# Altium project 烘干机.PrjPcb
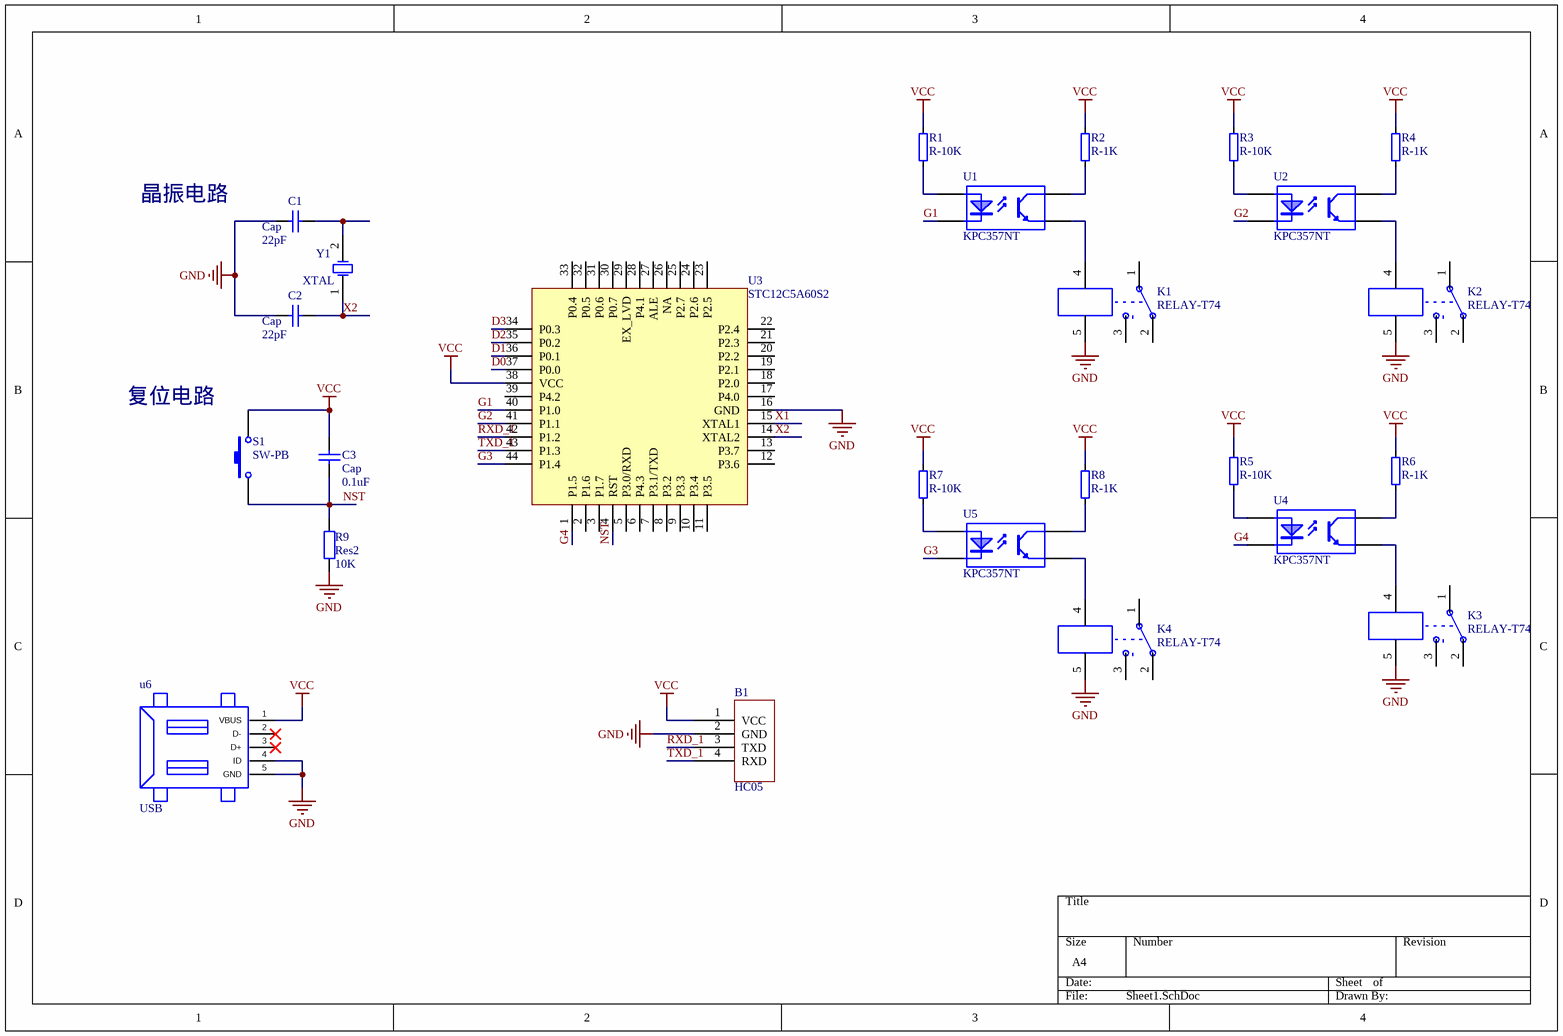
[diagram p0: Sheet1.SchDoc]
1 sheet, 25 parts. Net scope: global (net labels, ports and power ports of the same name join across sheets).

## Sheet Sheet1.SchDoc
size A4

### Parts
B1  HC05
C1  Cap  value 22pF  [RAD-0.3]
C2  Cap  value 22pF  [RAD-0.3]
C3  Cap  value 0.1uF  [RAD-0.3]
K1  RELAY-T74  [RELAY-T74]
K2  RELAY-T74  [RELAY-T74]
K3  RELAY-T74  [RELAY-T74]
K4  RELAY-T74  [RELAY-T74]
R1  R-10K  [0805R]
R2  R-1K  [0805R]
R3  R-10K  [0805R]
R4  R-1K  [0805R]
R5  R-10K  [0805R]
R6  R-1K  [0805R]
R7  R-10K  [0805R]
R8  R-1K  [0805R]
R9  Res2  value 10K  [AXIAL-0.4]
S1  SW-PB  [SPST-2]
U1  KPC357NT  [DIP-4]
U2  KPC357NT  [DIP-4]
U3  STC12C5A60S2  [TQFP-44]
U4  KPC357NT  [DIP-4]
U5  KPC357NT  [DIP-4]
u6  USB
Y1  XTAL  [R38]

### Nets
GND: B1.2(GND) C1.1 C2.1 K1.5 K2.5 K3.5 K4.5 R9.1 U3.16(GND) u6.4(ID) u6.5(GND)
VCC: B1.1(VCC) C3.2 R1.2 R2.2 R3.2 R4.2 R5.2 R6.2 R7.2 R8.2 S1.2 U3.38(VCC) u6.1(VBUS)
D0: U3.37(P0.0)
D1: U3.36(P0.1)
D2: U3.35(P0.2)
D3: U3.34(P0.3)
G1: U1.2(K) U3.40(P1.0)
G2: U2.2(K) U3.41(P1.1)
G3: U3.44(P1.4) U5.2(K)
G4: U3.1(P1.5) U4.2(K)
NST: C3.1 R9.2 S1.1 U3.4(RST)
RXD_1: B1.3(TXD) U3.42(P1.2)
TXD_1: B1.4(RXD) U3.43(P1.3)
X1: U3.15(XTAL1)
X2: C2.2 U3.14(XTAL2) Y1.1(OSC1)
NetC1_2: C1.2 Y1.2(OSC2)
NetK1_4: K1.4 U1.3(E)
NetK2_4: K2.4 U2.3(E)
NetK3_4: K3.4 U4.3(E)
NetK4_4: K4.4 U5.3(E)
NetR1_1: R1.1 U1.1(A)
NetR2_1: R2.1 U1.4(C)
NetR3_1: R3.1 U2.1(A)
NetR4_1: R4.1 U2.4(C)
NetR5_1: R5.1 U4.1(A)
NetR6_1: R6.1 U4.4(C)
NetR7_1: R7.1 U5.1(A)
NetR8_1: R8.1 U5.4(C)

Not connected (* = marked no-connect by the designer): K1 1 2 3; K2 1 2 3; K3 1 2 3; K4 1 2 3; U3 2(P1.6) 3(P1.7) 5(P3.0/RXD) 6(P4.3) 7(P3.1/TXD) 8(P3.2) 9(P3.3) 10(P3.4) 11(P3.5) 12(P3.6) 13(P3.7) 17(P4.0) 18(P2.0) 19(P2.1) 20(P2.2) 21(P2.3) 22(P2.4) 23(P2.5) 24(P2.6) 25(P2.7) 26(NA) 27(ALE) 28(P4.1) 29(EX_LVD) 30(P0.7) 31(P0.6) 32(P0.5) 33(P0.4) 39(P4.2); u6 2(D-)* 3(D+)*

### Notes on the sheet
- 晶振电路
- 复位电路

### Library data of the parts
B1 = BT06
C1-C3 = Cap: Capacitor; Published: 8-Jun-2000; LatestRevisionDate: 17-Jul-2002; LatestRevisionNote: Re-released for DXP Platform.; PackageReference: RAD-0.3; Publisher: Altium Limited; PackageDescription: Radial Cap, Thru-Hole; 2 Leads; 0.3 in Pin Spacing
K1-K4 = RELAY-T74: CN-RELAY-T74
R1-R8 = R-10K: resistor
R9 = Res2: Resistor; Published: 8-Jun-2000; LatestRevisionDate: 17-Jul-2002; LatestRevisionNote: Re-released for DXP Platform.; PackageReference: AXIAL-0.4; Publisher: Altium Limited; PackageDescription: Axial Device, Thru-Hole; 2 Leads; 0.4 in Pin Spacing
S1 = SW-PB: Switch; Published: 24-Mar-1999; LatestRevisionDate: 17-Jul-2002; LatestRevisionNote: Re-released for DXP Platform.; PackageReference: SPST-2; Publisher: Altium Limited; PackageDescription: Switch; 2 Leads
Y1 = XTAL: Crystal Oscillator; Published: 8-Jun-2000; LatestRevisionDate: 17-Jul-2002; LatestRevisionNote: Re-released for DXP Platform.; PackageReference: R38; Publisher: Altium Limited; PackageDescription: Crystal, Thru-Hole; 2 Leads; Body 3.1 x 8.2 mm (Dia.xH)
U1 U2 U4 U5 = KPC357NT: Published: 24-Mar-1999; LatestRevisionDate: 17-Jul-2002; LatestRevisionNote: Re-released for DXP Platform.; Publisher: Altium Limited